# Altium schematic sheet tsal-logic.SchDoc: tsal-logic
size A4; Date: 05.10.2017; CheckedBy: Nico Bieberich; Author: Leon Loeser; Organization: Baltic Racing; Address1: Zur Schwedenschanze 15; Address2: Haus 18; Address3: 18435 Stralsund; Revision: xx.xx; SheetNumber: 4; SheetTotal: 9; Rules: EV4.10; ProjectName: Projekt
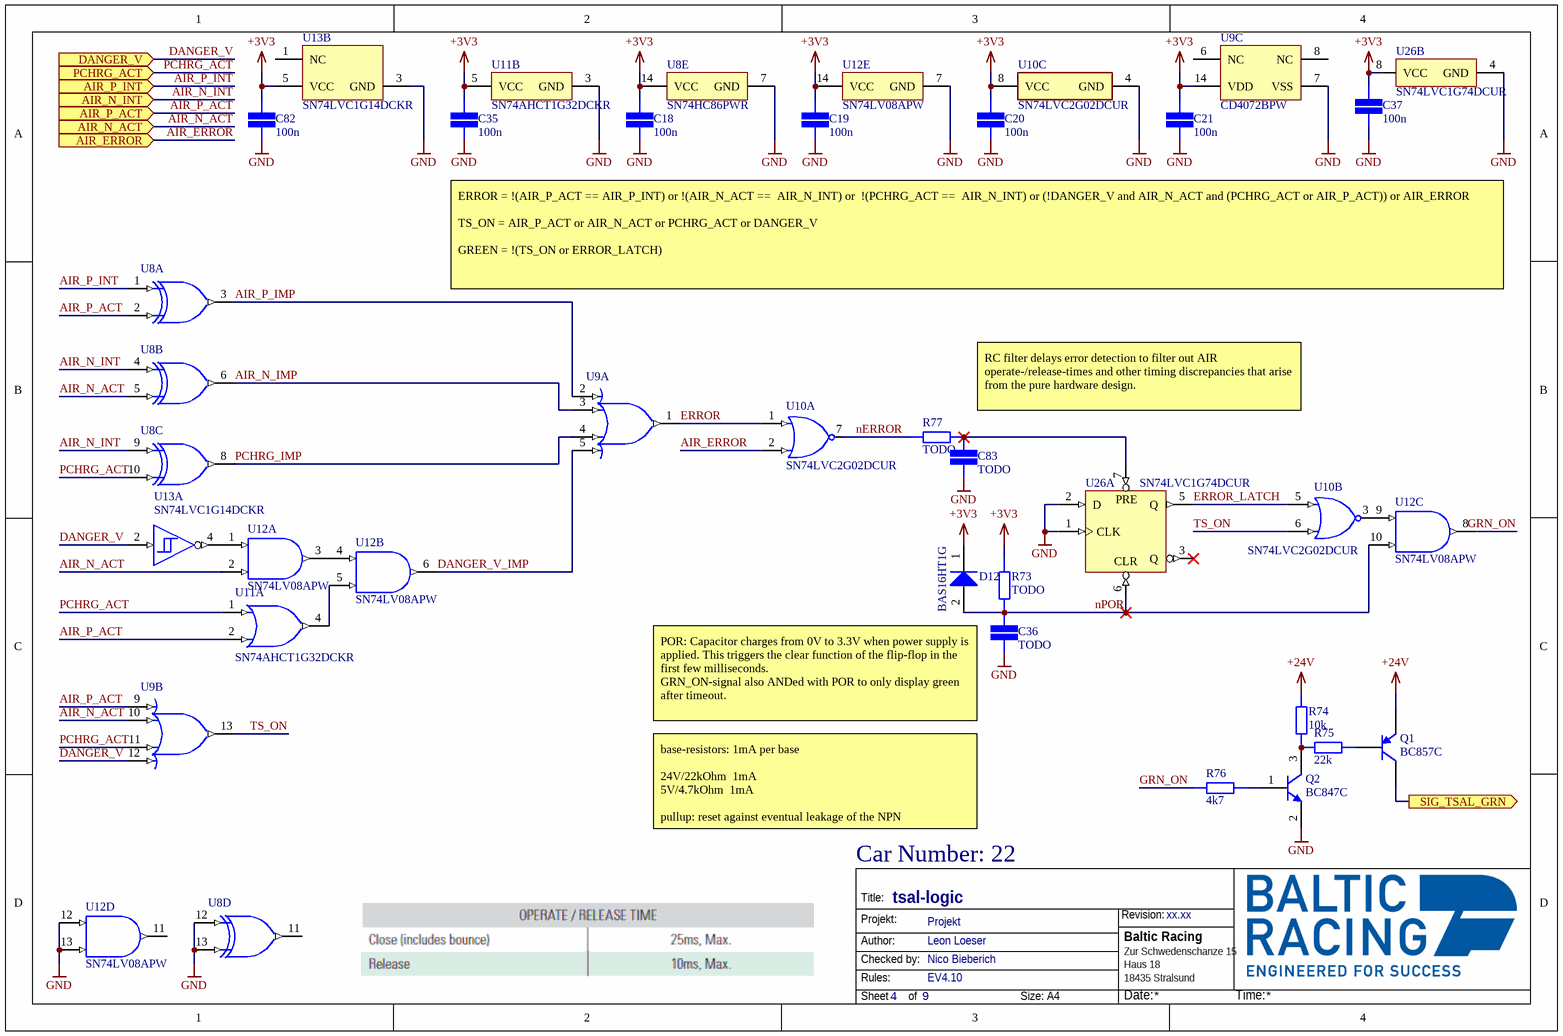
[diagram p0: tsal-logic.SchDoc]

## Parts
C18  value 100n  [CAP 0603/1608]  (hidden comment: SMD Capacitor)
C19  value 100n  [CAP 0603/1608]  (hidden comment: SMD Capacitor)
C20  value 100n  [CAP 0603/1608]  (hidden comment: SMD Capacitor)
C21  value 100n  [CAP 0603/1608]  (hidden comment: SMD Capacitor)
C35  value 100n  [CAP 0603/1608]  (hidden comment: SMD Capacitor)
C36  value TODO  [CAP 1206/3216]  (hidden comment: SMD Capacitor)
C37  value 100n  [CAP 0603/1608]  (hidden comment: SMD Capacitor)
C82  value 100n  [CAP 0603/1608]  (hidden comment: SMD Capacitor)
C83  value TODO  [CAP 1206/3216]  (hidden comment: SMD Capacitor)
D12  BAS16HT1G  [ONSC-SOD-323-2-477-02_V]
Q1  BC857C  [INF-SOT23_N]
Q2  BC847C  [INF-SOT23_L]
R73  value TODO  [STACKPOLE CSR0603]  (hidden comment: SMD Resistor)
R74  value 10k  [STACKPOLE CSR0603]  (hidden comment: SMD Resistor)
R75  value 22k  [STACKPOLE CSR0603]  (hidden comment: SMD Resistor)
R76  value 4k7  [STACKPOLE CSR0603]  (hidden comment: SMD Resistor)
R77  value TODO  [STACKPOLE CSR0603]  (hidden comment: SMD Resistor)
U8  SN74HC86PWR  [PW0014A_M]  (value not drawn)  (parts A,B,C,D,E of 5)
U9  CD4072BPW  [PW0014A_M]  (value not drawn)  (parts A,B,C of 3)
U10  SN74LVC2G02DCUR  [FP-DCU0008A-MFG]  (parts A,B,C of 3)
U11  SN74AHCT1G32DCKR  [DCK0005A_M]  (parts A,B of 2)
U12  SN74LV08APW  [PW0014A_N]  (parts A,B,C,D,E of 5)
U13  SN74LVC1G14DCKR  [DCK0005A_L]  (parts A,B of 2)
U26  SN74LVC1G74DCUR  [DCU0008A_L]  (parts A,B of 2)

## Ports
AIR_ERROR (in), AIR_N_ACT (in), AIR_N_INT (in), AIR_P_ACT (in), AIR_P_INT (in), DANGER_V (in), PCHRG_ACT (in), SIG_TSAL_GRN (out)

## Nets
+3V3: C18.1 C19.1 C20.1 C21.1 C35.1 C37.1 C82.1 D12.1(K) R73.2 U8.14(VCC) U9.14(VDD) U10.8(VCC) U11.5(VCC) U12.14(VCC) U13.5(VCC) U26.8(VCC)
+24V: Q1.2(E) R74.1
GND: C18.2 C19.2 C20.2 C21.2 C35.2 C36.1 C37.2 C82.2 C83.1 Q2.2(E) U8.7(GND) U8.12(4A) U8.13(4B) U9.7(VSS) U10.4(GND) U11.3(GND) U12.7(GND) U12.12(4A) U12.13(4B) U13.3(GND) U26.1(CLK) U26.2(D) U26.4(GND)
AIR_ERROR: U10.2(1B) ; port AIR_ERROR
AIR_N_ACT: U8.5(2B) U9.10(F) U12.2(1B) ; port AIR_N_ACT
AIR_N_IMP: U8.6(2Y) U9.3(B)
AIR_N_INT: U8.4(2A) U8.9(3A) ; port AIR_N_INT
AIR_P_ACT: U8.2(1B) U9.9(E) U11.2(B) ; port AIR_P_ACT
AIR_P_IMP: U8.3(1Y) U9.2(A)
AIR_P_INT: U8.1(1A) ; port AIR_P_INT
DANGER_V: U9.12(H) U13.2(A) ; port DANGER_V
DANGER_V_IMP: U9.5(D) U12.6(2Y)
ERROR: U9.1(J) U10.1(1A)
ERROR_LATCH: U10.5(2A) U26.5(Q)
GRN_ON: R76.2 U12.8(3Y)
nERROR: R77.2 U10.7(1Y)
nPOR: C36.2 D12.2(A) R73.1 U12.10(3B) U26.6(~{CLR})
PCHRG_ACT: U8.10(3B) U9.11(G) U11.1(A) ; port PCHRG_ACT
PCHRG_IMP: U8.8(3Y) U9.4(C)
SIG_TSAL_GRN: Q1.3(C) ; port SIG_TSAL_GRN
TS_ON: U9.13(K) U10.6(2B)
NetC83_2: C83.2 R77.1 U26.7(~{PRE})
NetQ1_1: Q1.1(B) R75.1
NetQ2_1: Q2.1(B) R76.1
NetQ2_3: Q2.3(C) R74.2 R75.2
NetU10_3: U10.3(2Y) U12.9(3A)
NetU11_4: U11.4(Y) U12.5(2B)
NetU12_1: U12.1(1A) U13.4(Y)
NetU12_3: U12.3(1Y) U12.4(2A)

Not connected (* = marked no-connect by the designer): U8 11(4Y); U9 6(NC) 8(NC); U12 11(4Y); U13 1(NC); U26 3(Q)*

## Notes on the sheet
- ERROR = !(AIR_P_ACT == AIR_P_INT) or !(AIR_N_ACT ==  AIR_N_INT) or  !(PCHRG_ACT ==  AIR_N_INT) or (!DANGER_V and AIR_N_ACT and (PCHRG_ACT or AIR_P_ACT)) or AIR_ERROR
  TS_ON = AIR_P_ACT or AIR_N_ACT or PCHRG_ACT or DANGER_V
  GREEN = !(TS_ON or ERROR_LATCH)
- RC filter delays error detection to filter out AIR operate-/release-times and other timing discrepancies that arise from the pure hardware design.
- POR: Capacitor charges from 0V to 3.3V when power supply is applied. This triggers the clear function of the flip-flop in the first few milliseconds.
  GRN_ON-signal also ANDed with POR to only display green after timeout.
- base-resistors: 1mA per base
  24V/22kOhm  1mA
  5V/4.7kOhm  1mA
  pullup: reset against eventual leakage of the NPN
- Car Number: 22
- Title:
- Projekt:
- Revision:
- Author:
- Rules:
- Checked by:
- Sheet
- of
- Size:
- A4
- Date:
- Time:
- (in symbol CMP-0859-00701-3, part A) PRE; CLR

## Library data of the parts
C18-C21 C35-C37 C82 C83 = SMD Capacitor: Capacitor with multiple Footprints; Voltage: 6.3V
D12 = CMP-1054-00068-1: Switching Diode, 2-Pin SOD-323, Pb-Free, Tape and Reel; Manufacturer: On Semiconductor; Configuration: Single; IF Max (A): 0.2; trr Max (ns): 6; Packing: Tape and Reel; ComponentLink2URL: http://www.onsemi.com/pub_link/Collateral/BAS16HT1-D.PDF; ComponentLink3Description: Package Specification; RoHS: TRUE; PackageDescription: 2-Pin SOD, Body 1.7 x 1.25 mm; PackageReference: SOD-323-2-477-02; PartNumber: BAS16HT1G; ComponentLink1URL: http://www.onsemi.com/; Mounting Technology: Surface Mount; ComponentLink1Description: Manufacturer URL; ComponentLink2Description: Datasheet; DatasheetVersion: Rev. 11; PackageVersion: Rev. H, 03/2007; ComponentLink3URL: http://www.onsemi.com/pub_link/Collateral/477-02.PDF.1
Q1 = CMP-1177-00039-1: PNP Silicon AF Transistor, 45 V VCEO, 100 mA IC, SOT23, Reel, Green; Manufacturer: Infineon; VCBO (max): 50Â V; fT (typ): 250Â MHz; ICBO (max): 15Â nA; IC (max): 100Â mA; Green: TRUE; IBM (max): 200Â mA; VEBO (max): 5Â V; VCEO (max): 45Â V; Ptot (max): 330Â mW; PackageDescription: 3-Pin Small Outline Transistor Package, 1.3 x 2.9 mm Body, 0.95 mm Pitch; ComponentLink2Description: Datasheet; PackageReference: SOT23; ComponentLink3Description: Package Specification; ComponentLink1URL: http://www.infineon.com/; ComponentLink1Description: Manufacturer URL; Mounting Technology: Surface Mount; PackageVersion: Apr-08; ComponentLink3URL: http://www.infineon.com/dgdl/SOT23-Package_Overview.pdf?folderId=db3a30431936bc4b0119532290053c66&fileId=db3a30431936bc4b0119533468123c85; ComponentLink2URL: http://www.infineon.com/dgdl/bc857series_bc858series_bc859series_bc860series.pdf?folderId=db3a304314dca389011541d30fa21656&fileId=db3a304314dca389011541da0e3a1661; Polarity: PNP; ICM (max): 200Â mA; PartNumber: BC857C; Packing: Reel
Q2 = CMP-1177-00037-1: NPN Silicon AF Transistor, 45 V VCEO, 100 mA IC, SOT23, Reel, Green; Manufacturer: Infineon; VCEO (max): 45Â V; VEBO (max): 6Â V; fT (typ): 250Â MHz; VCBO (max): 50Â V; ICM (max): 200Â mA; Green: TRUE; IC (max): 100Â mA; Ptot (max): 330Â mW; ICBO (max): 15Â nA; PartNumber: BC847C; ComponentLink3URL: http://www.infineon.com/dgdl/SOT23-Package_Overview.pdf?folderId=db3a30431936bc4b0119532290053c66&fileId=db3a30431936bc4b0119533468123c85; ComponentLink3Description: Package Specification; Mounting Technology: Surface Mount; PackageDescription: 3-Pin Small Outline Transistor Package, 1.3 x 2.9 mm Body, 0.95 mm Pitch; PackageReference: SOT23; ComponentLink2URL: http://www.infineon.com/dgdl/bc847series_bc848series_bc849series_bc850series.pdf?folderId=db3a304314dca389011541d30fa21656&fileId=db3a304314dca389011541d4630a1657; ComponentLink2Description: Datasheet; ComponentLink1Description: Manufacturer URL; Polarity: NPN; ComponentLink1URL: http://www.infineon.com/; IBM (max): 200Â mA; Packing: Reel; PackageVersion: Apr-08
R73-R77 = SMD Resistor: Resistor with multiple footprints
U8 = CMP-0778-00135-3: Quadruple 2-Input Exclusive-OR Gates, PW0014A, LARGE T&R; Manufacturer: Texas Instruments; Technology Family: HC; tpd @ Nom Voltage(Max)(ns): 21; Schmitt Trigger: No; Bits(#): 4; Output Drive (IOL/IOH)(Max)(mA): 5.2/-5.2; Rating: Catalog; Input Type: CMOS; Voltage(Nom)(V): 5; ICC @ Nom Voltage(Max)(mA): 0.02; VCC(Min)(V): 2; VCC(Max)(V): 6; F @ Nom Voltage(Max)(Mhz): 70; Generic Part Number: SN74HC86; Operating Temperature Range(C): -40 to 85; PackageReference: PW0014A; DatasheetVersion: SCLS100E; Output Type: CMOS
U9 = CMP-1573-00202-3: CMOS Dual 4-Input OR Gate, PW0014A, TUBE; Manufacturer: Texas Instruments; Voltage(Nom)(V): 10; tpd @ Nom Voltage(Max)(ns): 120; Rating: Catalog; VCC(Max)(V): 18; ICC @ Nom Voltage(Max)(mA): 0.015; VCC(Min)(V): 3; Output Drive (IOL/IOH)(Max)(mA): 1.5/-1.5; F @ Nom Voltage(Max)(Mhz): 8; Bits(#): 2; Code_JEDEC: MO-153; Output Type: CMOS; Input Type: CMOS; PackageReference: PW0014A; Generic Part Number: CD4072B; Operating Temperature Range(C): -55 to 125; DatasheetVersion: SCHS056D; PackageVersion: http://www.ti.com/lit/ml/mpds360/mpds360.pdf
U10 = CMP-0859-00696-4: NOR Gate IC 2 Channel  8-VSSOP; Manufacturer: Texas Instruments; Max Supply Voltage: 5.5V; Number Of Circuits: 2; Nominal Supply Current: 10uA; Number Of Outputs: 1; Standoff Height: 0mm; Max Junction Temp: +150°C; Min Supply Voltage: 1.65V; Propagation Delay: 5.4ns; Frequency: 100MHz; RoHS: TRUE; Device Class L2: Logic ICs; Device Class L3: Logic Gates; Device Class L1: Integrated Circuits (ICs); Manufacturer Part Number: SN74LVC2G02DCUR; Automotive: No; Octopart: https://octopart.com/sn74lvc2g02dcur-texas+instruments-464558; Logic Function Desc: NOR; Temperature Range Low: -40°C; Number Of Inputs: 2; Ambient Temperature Range High: +125°C; Package: DCU0008A; ComponentLink2Description: Datasheet; Mouser Description: Dual 2-Input Positive-NOR Gate 8-VSSOP -40 to 125; Ambient Temperature Range Low: -40°C; Category: IC; Temperature Range High: +125°C; Temperature: -40°C to +125°C; Lead Free: Yes; ComponentLink2URL: http://www.ti.com/lit/ds/symlink/sn74lvc2g02.pdf; Height: 0.9mm; Digikey Description: NOR Gate IC 2 Channel  8-VSSOP
U11 = CMP-0859-00275-3: Single 2-Input Positive-OR Gate, DCK0005A, LARGE T&R; Manufacturer: Texas Instruments; Logic: True; Output Drive (IOL/IOH)(Max)(mA): 8/-8; VCC(Min)(V): 2; Input Type: CMOS; ICC @ Nom Voltage(Max)(mA): 0.01; tpd @ Nom Voltage(Max)(ns): 8; Bits(#): 1; Voltage(Nom)(V): 5; VCC(Max)(V): 5.5; Technology Family: AHCT; Rating: Catalog; Sub-Family: OR Gate; Gate Type: OR; F @ Nom Voltage(Max)(Mhz): 75; 3-State Output: No; PackageReference: DCK0005A; Output Type: CMOS; DatasheetVersion: SCLS320O; Operating Temperature Range(C): -40 to 125; Generic Part Number: SN74AHCT1G32; Schmitt Trigger: No
U12 = CMP-0777-00327-3: Quadruple 2-Input Positive-AND Gates, PW0014A, TUBE; Manufacturer: Texas Instruments; Output Type: TTL; VCC(Min)(V): 2; Schmitt Trigger: No; Bits(#): 4; Rating: Catalog; F @ Nom Voltage(Max)(Mhz): 70; Output Drive (IOL/IOH)(Max)(mA): -50/50; tpd @ Nom Voltage(Max)(ns): 16,10.5,7; Voltage(Nom)(V): 2.5,3.3,5; VCC(Max)(V): 5.5; ICC @ Nom Voltage(Max)(mA): 0.02; Technology Family: LV-A; DatasheetVersion: SCLS387M; Input Type: TTL; PackageReference: PW0014A; Operating Temperature Range(C): -40 to 125,-40 to 85; Generic Part Number: SN74LV08A
U13 = CMP-0859-00440-4: Single Schmitt-Trigger Inverter, DCK0005A, LARGE T&R; Manufacturer: Texas Instruments; Output Drive (IOL/IOH)(Max)(mA): 32/-32; Schmitt Trigger: Yes; Logic: Inverting; Bits(#): 1; Rating: Catalog; tpd @ Nom Voltage(Max)(ns): 11,6.5,5.5,5; Voltage(Nom)(V): 1.8,2.5,3.3,5; Output Type: CMOS; VCC(Min)(V): 1.65; ICC @ Nom Voltage(Max)(mA): 0.01; Input Type: CMOS/TTL; F @ Nom Voltage(Max)(Mhz): 150; VCC(Max)(V): 5.5; Sub-Family: Inverting Buffer/Driver; 3-State Output: No; Technology Family: LVC; PackageReference: DCK0005A; Operating Temperature Range(C): -40 to 125,-40 to 85; Generic Part Number: SN74LVC1G14; DatasheetVersion: SCES218W
U26 = CMP-0859-00701-3: Single Positive-Edge-Triggered D-Type Flip-Flop With Clear and Preset, DCU0008A, LARGE T&R; Manufacturer: Texas Instruments; Rating: Catalog; Technology Family: LVC; Output Type: CMOS; VCC(Max)(V): 5.5; ICC @ Nom Voltage(Max)(mA): 0.01; Output Drive (IOL/IOH)(Max)(mA): 32/-32; 3-State Output: No; VCC(Min)(V): 1.65; Input Type: CMOS/TTL; Logic: True; Bits(#): 1; Voltage(Nom)(V): 1.8,2.5,3.3,5; tpd @ Nom Voltage(Max)(ns): 13.4,7.1,5.9,4.1; F @ Nom Voltage(Max)(Mhz): 150; PackageReference: DCU0008A; Sub-Family: D-Type Flip-Flop; Schmitt Trigger: No; DatasheetVersion: SCES794E; Generic Part Number: SN74LVC1G74; Operating Temperature Range(C): -40 to 125